# Altium schematic sheet Connector_Card.SchDoc: Delayed Egress
size A4; CheckedBy: DMH; Organization: Detex; Address2: 302 Detex Dr; Address3: New Braunfels, TX 78130; Address4: (830) 629-290; DocumentNumber: 107029; Revision: A0; SheetNumber: 3; SheetTotal: 9
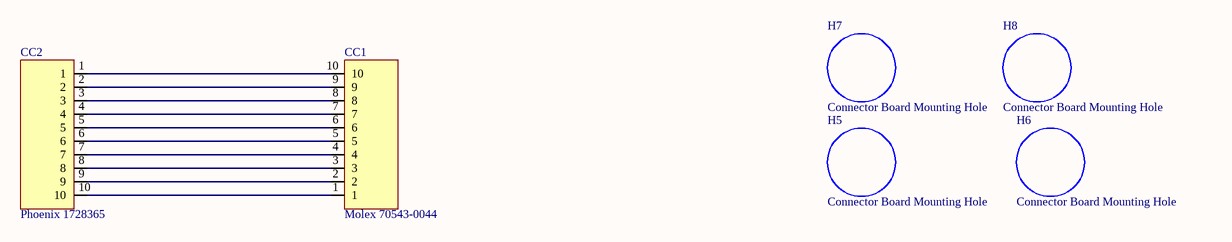
[diagram p0: Connector_Card.SchDoc]

## Parts
CC1  Molex 70543-0044  [10 Pin Molex Vertical]
CC2  Phoenix 1728365  [Phoenix 1728365]
H5  Connector Board Mounting Hole  [Mount Hole Connector Board]  (no BOM)
H6  Connector Board Mounting Hole  [Mount Hole Connector Board]  (no BOM)
H7  Connector Board Mounting Hole  [Mount Hole Connector Board]  (no BOM)
H8  Connector Board Mounting Hole  [Mount Hole Connector Board]  (no BOM)

## Nets
NetCC1_1: CC1.1 CC2.10
NetCC1_2: CC1.2 CC2.9
NetCC1_3: CC1.3 CC2.8
NetCC1_4: CC1.4 CC2.7
NetCC1_5: CC1.5 CC2.6
NetCC1_6: CC1.6 CC2.5
NetCC1_7: CC1.7 CC2.4
NetCC1_8: CC1.8 CC2.3
NetCC1_9: CC1.9 CC2.2
NetCC1_10: CC1.10 CC2.1

## Notes on the sheet
- Title
- Size:
- Date:
- A4
- Number:
- Time:
- Revision:
- Sheet
- of
- Detex Corporation
- 302 Detex Drive
- New Braunfels, TX
- 78130
- (830) 629-2900
- File:

## Library data of the parts
CC1 = Molex 70543-0044: Molex SL Vertical 1 x 10 header; MFR: Molex; MFR P/N: 70543-0044; ComponentLink1Description: Datasheet
CC2 = Phoenix 1728365: Phoenix PCB Connector, 1 x 10 pins; MFR: Phoenix; MFR P/N: 1728365; ComponentLink1Description: Datasheet